# EAGLE design Pixel-X_Display_v4_sk6805-2427-40pixel_0.97x_re_place-1 (EAGLE 7.7.0)
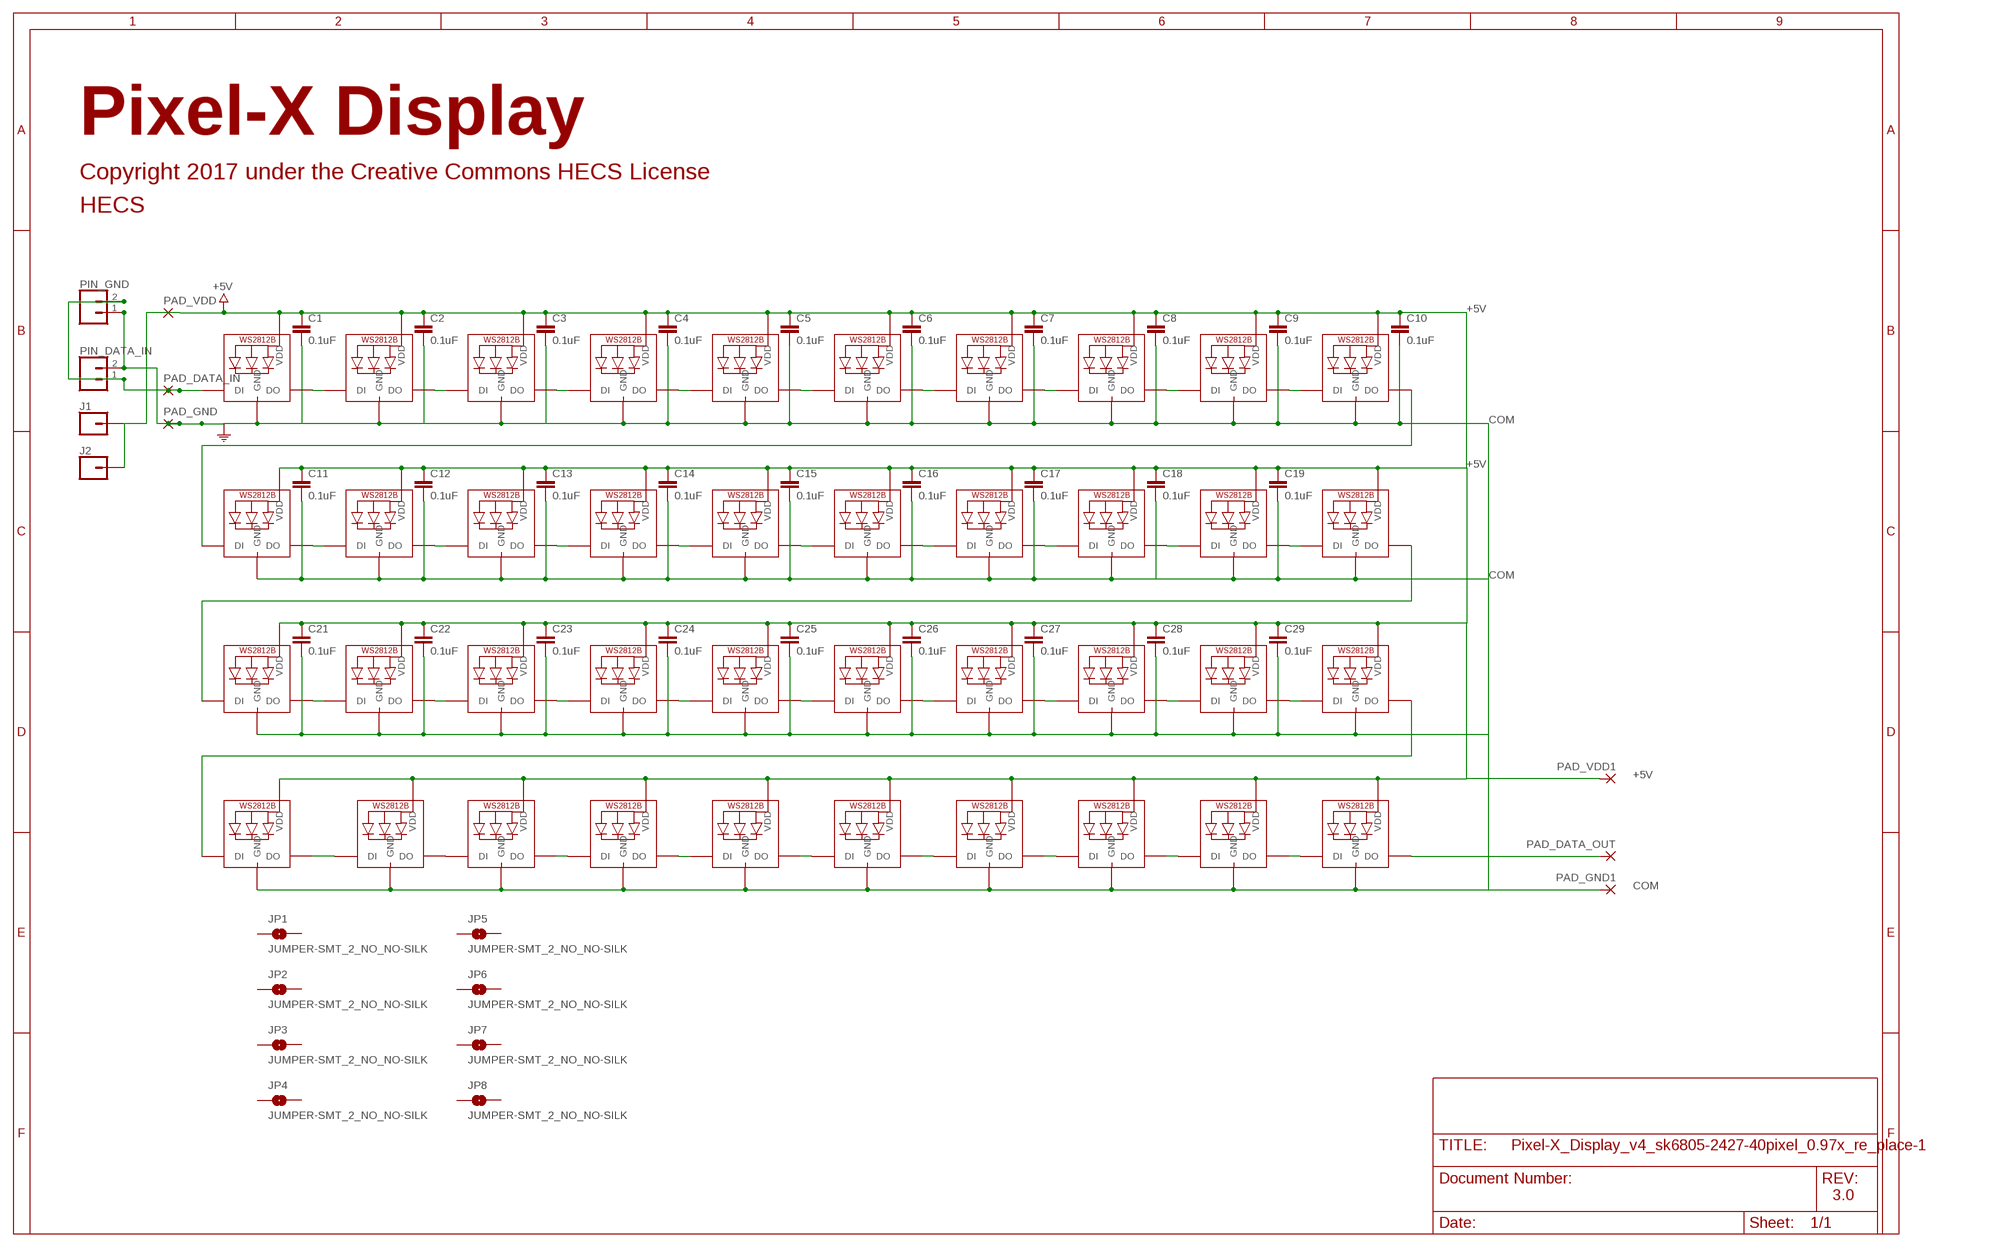
[diagram p0: schematic, sheet 1]

## Parts
C1  0.1uF  0.1UF-0603-25V-(+80/-20%)  [0603]
C2  0.1uF  0.1UF-0603-25V-(+80/-20%)  [0603]
C3  0.1uF  0.1UF-0603-25V-(+80/-20%)  [0603]
C4  0.1uF  0.1UF-0603-25V-(+80/-20%)  [0603]
C5  0.1uF  0.1UF-0603-25V-(+80/-20%)  [0603]
C6  0.1uF  0.1UF-0603-25V-(+80/-20%)  [0603]
C7  0.1uF  0.1UF-0603-25V-(+80/-20%)  [0603]
C8  0.1uF  0.1UF-0603-25V-(+80/-20%)  [0603]
C9  0.1uF  0.1UF-0603-25V-(+80/-20%)  [0603]
C10  0.1uF  0.1UF-0603-25V-(+80/-20%)  [0603]
C11  0.1uF  0.1UF-0603-25V-(+80/-20%)  [0603]
C12  0.1uF  0.1UF-0603-25V-(+80/-20%)  [0603]
C13  0.1uF  0.1UF-0603-25V-(+80/-20%)  [0603]
C14  0.1uF  0.1UF-0603-25V-(+80/-20%)  [0603]
C15  0.1uF  0.1UF-0603-25V-(+80/-20%)  [0603]
C16  0.1uF  0.1UF-0603-25V-(+80/-20%)  [0603]
C17  0.1uF  0.1UF-0603-25V-(+80/-20%)  [0603]
C18  0.1uF  0.1UF-0603-25V-(+80/-20%)  [0603]
C19  0.1uF  0.1UF-0603-25V-(+80/-20%)  [0603]
C21  0.1uF  0.1UF-0603-25V-(+80/-20%)  [0603]
C22  0.1uF  0.1UF-0603-25V-(+80/-20%)  [0603]
C23  0.1uF  0.1UF-0603-25V-(+80/-20%)  [0603]
C24  0.1uF  0.1UF-0603-25V-(+80/-20%)  [0603]
C25  0.1uF  0.1UF-0603-25V-(+80/-20%)  [0603]
C26  0.1uF  0.1UF-0603-25V-(+80/-20%)  [0603]
C27  0.1uF  0.1UF-0603-25V-(+80/-20%)  [0603]
C28  0.1uF  0.1UF-0603-25V-(+80/-20%)  [0603]
C29  0.1uF  0.1UF-0603-25V-(+80/-20%)  [0603]
J1  CONN_01  [1X01]
J2  CONN_01  [1X01]
JP1  JUMPER-SMT_2_NO_NO-SILK  [SMT-JUMPER_2_NO_NO-SILK]
JP2  JUMPER-SMT_2_NO_NO-SILK  [SMT-JUMPER_2_NO_NO-SILK]
JP3  JUMPER-SMT_2_NO_NO-SILK  [SMT-JUMPER_2_NO_NO-SILK]
JP4  JUMPER-SMT_2_NO_NO-SILK  [SMT-JUMPER_2_NO_NO-SILK]
JP5  JUMPER-SMT_2_NO_NO-SILK  [SMT-JUMPER_2_NO_NO-SILK]
JP6  JUMPER-SMT_2_NO_NO-SILK  [SMT-JUMPER_2_NO_NO-SILK]
JP7  JUMPER-SMT_2_NO_NO-SILK  [SMT-JUMPER_2_NO_NO-SILK]
JP8  JUMPER-SMT_2_NO_NO-SILK  [SMT-JUMPER_2_NO_NO-SILK]
LED1  WS2812BSK68052427  [LED3535]
LED2  WS2812BSK68052427  [LED3535]
LED3  WS2812BSK68052427  [LED3535]
LED4  WS2812BSK68052427  [LED3535]
LED5  WS2812BSK68052427  [LED3535]
LED6  WS2812BSK68052427  [LED3535]
LED7  WS2812BSK68052427  [LED3535]
LED8  WS2812BSK68052427  [LED3535]
LED9  WS2812BSK68052427  [LED3535]
LED10  WS2812BSK68052427  [LED3535]
LED11  WS2812BSK68052427  [LED3535]
LED12  WS2812BSK68052427  [LED3535]
LED13  WS2812BSK68052427  [LED3535]
LED14  WS2812BSK68052427  [LED3535]
LED15  WS2812BSK68052427  [LED3535]
LED16  WS2812BSK68052427  [LED3535]
LED17  WS2812BSK68052427  [LED3535]
LED18  WS2812BSK68052427  [LED3535]
LED19  WS2812BSK68052427  [LED3535]
LED20  WS2812BSK68052427  [LED3535]
LED21  WS2812BSK68052427  [LED3535]
LED22  WS2812BSK68052427  [LED3535]
LED23  WS2812BSK68052427  [LED3535]
LED24  WS2812BSK68052427  [LED3535]
LED25  WS2812BSK68052427  [LED3535]
LED26  WS2812BSK68052427  [LED3535]
LED27  WS2812BSK68052427  [LED3535]
LED28  WS2812BSK68052427  [LED3535]
LED29  WS2812BSK68052427  [LED3535]
LED30  WS2812BSK68052427  [LED3535]
LED31  WS2812BSK68052427  [LED3535]
LED32  WS2812BSK68052427  [LED3535]
LED33  WS2812BSK68052427  [LED3535]
LED34  WS2812BSK68052427  [LED3535]
LED35  WS2812BSK68052427  [LED3535]
LED36  WS2812BSK68052427  [LED3535]
LED37  WS2812BSK68052427  [LED3535]
LED38  WS2812BSK68052427  [LED3535]
LED39  WS2812BSK68052427  [LED3535]
LED40  WS2812BSK68052427  [LED3535]
PAD_DATA_IN  SMD5  [SMD2,54-5,08]
PAD_DATA_OUT  SMD5  [SMD2,54-5,08]
PAD_GND  SMD5  [SMD2,54-5,08]
PAD_GND1  SMD5  [SMD2,54-5,08]
PAD_VDD  SMD5  [SMD2,54-5,08]
PAD_VDD1  SMD5  [SMD2,54-5,08]
PIN_DATA_IN  CONN_02  [1X02]
PIN_GND  CONN_02  [1X02]

## Nets
+5V: C1.1 C2.1 C3.1 C4.1 C5.1 C6.1 C7.1 C8.1 C9.1 C10.1 C11.1 C12.1 C13.1 C14.1 C15.1 C16.1 C17.1 C18.1 C19.1 C21.1 C22.1 C23.1 C24.1 C25.1 C26.1 C27.1 C28.1 C29.1 J1.1 J2.1 LED1.2(VDD) LED2.2(VDD) LED3.2(VDD) LED4.2(VDD) LED5.2(VDD) LED6.2(VDD) LED7.2(VDD) LED8.2(VDD) LED9.2(VDD) LED10.2(VDD) LED11.2(VDD) LED12.2(VDD) LED13.2(VDD) LED14.2(VDD) LED15.2(VDD) LED16.2(VDD) LED17.2(VDD) LED18.2(VDD) LED19.2(VDD) LED20.2(VDD) LED21.2(VDD) LED22.2(VDD) LED23.2(VDD) LED24.2(VDD) LED25.2(VDD) LED26.2(VDD) LED27.2(VDD) LED28.2(VDD) LED29.2(VDD) LED30.2(VDD) LED31.2(VDD) LED32.2(VDD) LED33.2(VDD) LED34.2(VDD) LED35.2(VDD) LED36.2(VDD) LED37.2(VDD) LED38.2(VDD) LED39.2(VDD) LED40.2(VDD) PAD_VDD1.1(P) PAD_VDD.1(P)
COM: C1.2 C2.2 C3.2 C4.2 C5.2 C6.2 C7.2 C8.2 C9.2 C10.2 C11.2 C12.2 C13.2 C14.2 C15.2 C16.2 C17.2 C18.2 C19.2 C21.2 C22.2 C23.2 C24.2 C25.2 C26.2 C27.2 C28.2 C29.2 LED1.4(GND) LED2.4(GND) LED3.4(GND) LED4.4(GND) LED5.4(GND) LED6.4(GND) LED7.4(GND) LED8.4(GND) LED9.4(GND) LED10.4(GND) LED11.4(GND) LED12.4(GND) LED13.4(GND) LED14.4(GND) LED15.4(GND) LED16.4(GND) LED17.4(GND) LED18.4(GND) LED19.4(GND) LED20.4(GND) LED21.4(GND) LED22.4(GND) LED23.4(GND) LED24.4(GND) LED25.4(GND) LED26.4(GND) LED27.4(GND) LED28.4(GND) LED29.4(GND) LED30.4(GND) LED31.4(GND) LED32.4(GND) LED33.4(GND) LED34.4(GND) LED35.4(GND) LED36.4(GND) LED37.4(GND) LED38.4(GND) LED39.4(GND) LED40.4(GND) PAD_GND1.1(P) PAD_GND.1(P) PIN_DATA_IN.2 PIN_GND.1
N$1: LED1.1(DI) PAD_DATA_IN.1(P) PIN_DATA_IN.1 PIN_GND.2
N$2: LED1.3(DO) LED2.1(DI)
N$3: LED2.3(DO) LED3.1(DI)
N$4: LED3.3(DO) LED4.1(DI)
N$5: LED4.3(DO) LED5.1(DI)
N$6: LED5.3(DO) LED6.1(DI)
N$7: LED29.3(DO) LED30.1(DI)
N$8: LED6.3(DO) LED7.1(DI)
N$9: LED7.3(DO) LED8.1(DI)
N$10: LED8.3(DO) LED9.1(DI)
N$11: LED9.3(DO) LED10.1(DI)
N$12: LED10.3(DO) LED11.1(DI)
N$13: LED11.3(DO) LED12.1(DI)
N$14: LED12.3(DO) LED13.1(DI)
N$15: LED13.3(DO) LED14.1(DI)
N$16: LED15.3(DO) LED16.1(DI)
N$17: LED16.3(DO) LED17.1(DI)
N$18: LED17.3(DO) LED18.1(DI)
N$19: LED18.3(DO) LED19.1(DI)
N$20: LED19.3(DO) LED20.1(DI)
N$21: LED14.3(DO) LED15.1(DI)
N$22: LED20.3(DO) LED21.1(DI)
N$23: LED21.3(DO) LED22.1(DI)
N$24: LED22.3(DO) LED23.1(DI)
N$25: LED23.3(DO) LED24.1(DI)
N$26: LED24.3(DO) LED25.1(DI)
N$27: LED25.3(DO) LED26.1(DI)
N$28: LED26.3(DO) LED27.1(DI)
N$29: LED27.3(DO) LED28.1(DI)
N$30: LED28.3(DO) LED29.1(DI)
N$31: LED30.3(DO) LED31.1(DI)
N$32: LED39.3(DO) LED40.1(DI)
N$33: LED38.3(DO) LED39.1(DI)
N$34: LED37.3(DO) LED38.1(DI)
N$35: LED36.3(DO) LED37.1(DI)
N$36: LED35.3(DO) LED36.1(DI)
N$37: LED34.3(DO) LED35.1(DI)
N$38: LED33.3(DO) LED34.1(DI)
N$39: LED32.3(DO) LED33.1(DI)
N$40: LED31.3(DO) LED32.1(DI)
N$41: LED40.3(DO) PAD_DATA_OUT.1(P)
Unconnected: JP1.1 JP1.2 JP2.1 JP2.2 JP3.1 JP3.2 JP4.1 JP4.2 JP5.1 JP5.2 JP6.1 JP6.2 JP7.1 JP7.2 JP8.1 JP8.2

## Notes on the sheet
- Pixel-X Display
- Copyright 2017 under the Creative Commons HECS License
- HECS
- 3.0

## Library data of the parts
C1-C19 C21-C29 = SparkFun-Capacitors:0.1UF: 0.1µF ceramic capacitors A capacitor is a passive two-terminal electrical component used to store electrical energy temporarily in an electric field.; PROD_ID: CAP-00810
J1 J2 = SparkFun-Connectors:CONN_01: Single connection point. Often used as Generic Header-pin footprint for 0.1 inch spaced/style header connections On any of the 0.1 inch spaced packages, you can populate with these: Break Away Headers - Straight <https://www.sparkfun.com/products/116> (PRT-00116) Break Away Male Headers - Right Angle <https://www.sparkfun.com/products/553> (PRT-00553) Female Headers <https://www.sparkfun.com/products/115> (PRT-00115) Break Away Headers - Machine Pin <https://www.sparkfun.com/products/117> (PRT-00117) Break Away Female Headers - Swiss Machine Pin <https://www.sparkfun.com/products/743> (PRT-00743) This device is also useful as a general connection point to wire up your design to another part of your project. Our various solder wires solder well into these plated through hole pads. Hook-Up Wire - Assortment (Stranded, 22 AWG) <https://www.sparkfun.com/products/11375> (PRT-11375) Hook-Up Wire - Assortment (Solid Core, 22 AWG) <https://www.sparkfun.com/products/11367> (PRT-11367) View the entire wire category on our website here <https://www.sparkfun.com/categories/141> Special notes: SMTSO-256-ET is a "flush mount" nut for a 4-40 screw. We mostly use this on specialty testbeds; it is a nice way to connect hardware to your PCB at an adjustable hieght. Also note, the SNAP packages are for using a snappable style connector. We sell a baggie of snaps and they are also used on two LilyPad designs: Snap Assortment - 30 pack (male and female) <https://www.sparkfun.com/products/11347> (DEV-11347) LilyPad Arduino SimpleSnap <https://www.sparkfun.com/products/10941> (DEV-10941) LilyPad SimpleSnap Protoboard <https://www.sparkfun.com/products/10940> (DEV-10940)
JP1-JP8 = SparkFun-Jumpers:JUMPER-SMT_2_NO: Normally open jumper This jumper has two pads in close proximity to each other. Apply solder to close the connection. Round pads are easier to solder for beginners, but are a lot larger. SparkFun Product that uses the round pads: SparkFun EL Sequencer <https://www.sparkfun.com/products/12781>
LED1-LED40 = SK6805-2427:WS2812B
PAD_DATA_IN PAD_DATA_OUT PAD_GND PAD_GND1 PAD_VDD PAD_VDD1 = wirepad:SMD5: SMD PAD
PIN_DATA_IN PIN_GND = SparkFun-Connectors:CONN_02: Multi connection point. Often used as Generic Header-pin footprint for 0.1 inch spaced/style header connections On any of the 0.1 inch spaced packages, you can populate with these: Break Away Headers - Straight <https://www.sparkfun.com/products/116> (PRT-00116) Break Away Male Headers - Right Angle <https://www.sparkfun.com/products/553> (PRT-00553) Female Headers <https://www.sparkfun.com/products/115> (PRT-00115) Break Away Headers - Machine Pin <https://www.sparkfun.com/products/117> (PRT-00117) Break Away Female Headers - Swiss Machine Pin <https://www.sparkfun.com/products/743> (PRT-00743) For SCREWTERMINALS and SPRING TERMINALS visit here: Screw Terimnals on SparkFun.com <https://www.sparkfun.com/search/results?term=Screw+Terminals> (5mm/3.5mm/2.54mm spacing) This device is also useful as a general connection point to wire up your design to another part of your project. Our various solder wires solder well into these plated through hole pads. Hook-Up Wire - Assortment (Stranded, 22 AWG) <https://www.sparkfun.com/products/11375> (PRT-11375) Hook-Up Wire - Assortment (Solid Core, 22 AWG) <https://www.sparkfun.com/products/11367> (PRT-11367) View the entire wire category on our website here <https://www.sparkfun.com/categories/141> Special notes: Molex polarized connector foot print use with: PRT-08233 with associated crimp pins and housings. 2.54_SCREWTERM for use with PRT-10571. 3.5mm Screw Terminal footprints for PRT-08084 5mm Screw Terminal footprints for use with PRT-08432

## Board
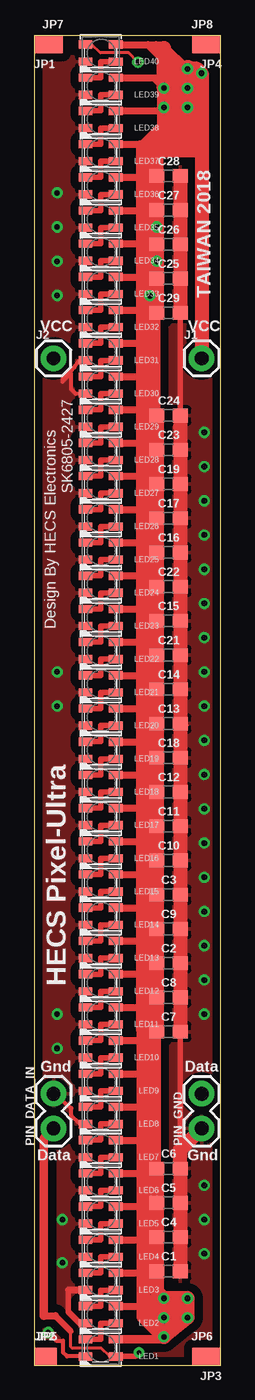
[diagram p1: board, top side]
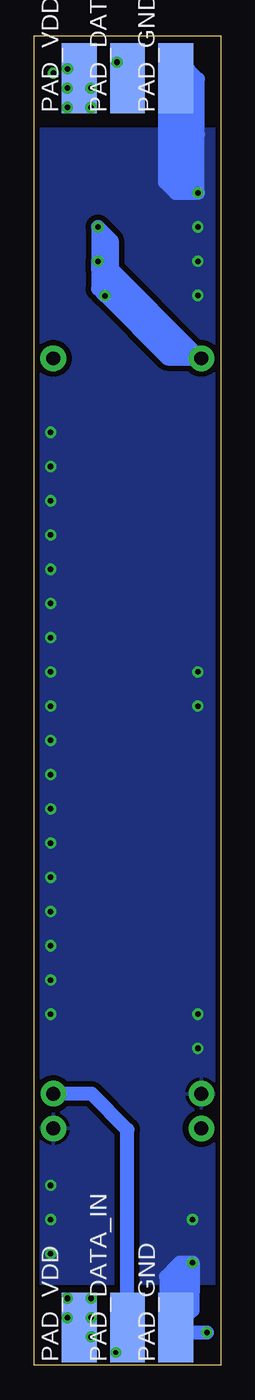
[diagram p2: board, bottom side, seen from below]

Size 13.6 x 97.07 mm. Coordinates in mm from the lower left corner, seen from the top.
Outline: 0,0 13.6,0 13.6,97.07 0,97.07 0,0
Copper layers (1*16): Top 0.035mm / dielectric 1.5mm / Bottom 0.035mm
Design rules "default *": minimum track width 8mil, minimum drill 16mil, track to track 8mil, track to pad 8mil, pad to pad 8mil, via to via 8mil, smd to smd 8mil, copper to edge 8mil, drill to drill 8mil, minimum pad ring 12mil, minimum via ring 8mil, stop-mask expansion 4mil, vias tented up to drill 18mil, thermal gap 10mil

### Footprints (pad centres in the part's own frame; a part is rotated, then mirrored left to right if it is on the bottom)
0603 = smd 1.1 x 1: 1 -0.85,0; 2 0.85,0
1X01 = drill 1.016 pad 1.88: 1 0,0
SMT-JUMPER_2_NO_NO-SILK = smd 0.635 x 1.27: 1 -0.406,0; 2 0.406,0
LED3535 = smd 1 x 0.6: 1 -1.5,0.075; 2 -1.5,-1.175; 3 0.7,-1.175; 4 0.7,0.075
SMD2,54-5,08 = smd 2.54 x 5.08: 1 0,0
1X02 = drill 1.016 pad 1.88: 1 0,0; 2 2.54,0

### Placement (x,y rotation side)
C1  9.8,6.86 0 top
C2  9.8,29.35 0 top
C3  9.8,34.35 0 top
C4  9.8,9.36 0 top
C5  9.8,11.86 0 top
C6  9.8,14.36 0 top
C7  9.8,24.36 0 top
C8  9.8,26.86 0 top
C9  9.8,31.85 0 top
C10  9.8,36.85 0 top
C11  9.8,39.35 0 top
C12  9.8,41.85 0 top
C13  9.8,46.85 0 top
C14  9.8,49.35 0 top
C15  9.8,54.34 0 top
C16  9.8,59.34 0 top
C17  9.8,61.84 0 top
C18  9.8,44.35 0 top
C19  9.8,64.34 0 top
C21  9.8,51.84 0 top
C22  9.8,56.84 0 top
C23  9.8,66.84 0 top
C24  9.8,69.34 0 top
C25  9.8,79.33 0 top
C26  9.8,81.83 0 top
C27  9.8,84.33 0 top
C28  9.8,86.83 0 top
C29  9.8,76.83 0 top
J1  12.21,73.51 0 top
J2  1.4,73.51 0 top
JP1  0.72,96.43 180 top
JP2  0.74,0.64 0 top
JP3  12.88,0.64 180 top
JP4  12.88,96.43 180 top
JP5  0.93,0.63 0 top
JP6  12.24,0.64 0 top
JP7  1.36,96.43 0 top
JP8  12.24,96.43 0 top
LED1  4.44,0.71 180 top
LED2  4.44,3.14 180 top
LED3  4.44,5.56 180 top
LED4  4.44,7.99 180 top
LED5  4.44,10.41 180 top
LED6  4.44,12.84 180 top
LED7  4.44,15.26 180 top
LED8  4.44,17.68 180 top
LED9  4.44,20.11 180 top
LED10  4.44,22.53 180 top
LED11  4.44,24.96 180 top
LED12  4.44,27.38 180 top
LED13  4.44,29.8 180 top
LED14  4.44,32.23 180 top
LED15  4.44,34.65 180 top
LED16  4.44,37.08 180 top
LED17  4.44,39.5 180 top
LED18  4.44,41.92 180 top
LED19  4.44,44.35 180 top
LED20  4.44,46.77 180 top
LED21  4.44,49.2 180 top
LED22  4.44,51.62 180 top
LED23  4.44,54.04 180 top
LED24  4.44,56.47 180 top
LED25  4.44,58.89 180 top
LED26  4.44,61.32 180 top
LED27  4.44,63.74 180 top
LED28  4.44,66.16 180 top
LED29  4.44,68.59 180 top
LED30  4.44,71.01 180 top
LED31  4.44,73.44 180 top
LED32  4.44,75.86 180 top
LED33  4.44,78.28 180 top
LED34  4.44,80.71 180 top
LED35  4.44,83.13 180 top
LED36  4.44,85.56 180 top
LED37  4.44,87.98 180 top
LED38  4.44,90.4 180 top
LED39  4.44,92.83 180 top
LED40  4.44,95.25 180 top
PAD_DATA_IN  6.8,2.75 0 bottom
PAD_DATA_OUT  6.8,93.97 0 bottom
PAD_GND  3.27,2.76 0 bottom
PAD_GND1  3.29,93.97 0 bottom
PAD_VDD  10.32,2.76 0 bottom
PAD_VDD1  10.32,93.97 0 bottom
PIN_DATA_IN  1.4,17.28 90 top
PIN_GND  12.21,17.28 90 top

### Tracks (layer width: path | path; a pad name or v marks a point on that pad's centre or on a via)
+5V  (via drill 0.41)
  Top 0.508: 8.95,74.3 C29.1 8.93,76.86 8.36,76.86 7.89,76.86 | 8.95,74.3 8.95,71.84 | 8.95,71.84 C24.1 8.53,69.34 7.89,69.34 | 8.95,21.77 C7.1 8.93,24.38 | 8.95,21.77 8.95,19.37 | 8.95,19.37 8.95,16.91 | 8.95,16.91 C6.1 8.93,14.38 8.38,14.38 7.99,14.38 | 8.96,4.39 v9.46,4.89 | 8.93,16.88 8.95,16.91 | 8.94,19.38 8.95,19.37 | 8.83,21.88 8.95,21.77 | 7.96,24.38 8.03,24.38 | 8.93,26.88 C8.1 | 8.93,29.38 C2.1 | 8.93,31.88 C9.1 | 8.93,36.88 C10.1 | 8.93,41.87 C12.1 | 8.93,44.37 C18.1 | 8.93,46.87 C13.1 | 8.93,49.37 C14.1 | 8.93,54.37 C15.1 | 8.93,56.87 C22.1 | 8.93,59.37 C16.1 | 8.93,71.86 8.95,71.84 | 8.89,74.36 8.95,74.3 | 8.93,79.36 C25.1 | 8.93,81.86 C26.1 | 8.93,84.36 C27.1 | LED40.2 8.28,96.43 | 8.28,96.43 8.88,96.43 | 8.88,96.43 9.41,96.43 v11.18,94.66 | LED39.2 8.71,94 | 8.71,94 v9.46,93.25 | 8.71,94 10.24,94 10.53,94 v11.18,94.66 | LED38.2 9.45,91.58 9.46,91.59 | LED37.2 7.7,89.16 7.96,88.89 | LED36.2 7.64,86.73 7.96,86.41 | LED35.2 7.74,84.31 7.96,84.08 | LED34.2 7.83,81.88 7.96,81.75 | LED33.2 7.9,79.46 7.96,79.4 | LED32.2 7.93,77.03 7.96,77.07 | LED31.2 7.88,74.61 7.89,74.61 | LED30.2 7.85,72.19 7.89,72.15 | LED29.2 7.69,69.76 7.96,70.04 | LED28.2 7.61,67.34 7.96,67.69 | LED27.2 7.58,64.92 7.96,65.3 | LED26.2 7.91,62.49 7.96,62.44 | LED25.2 7.95,60.07 7.96,60.08 | LED24.2 7.95,57.64 7.96,57.63 | LED23.2 7.96,55.22 | LED22.2 7.9,52.8 7.96,52.74 | LED21.2 7.96,50.37 7.96,50.38 | LED20.2 7.94,47.95 7.96,47.97 | LED19.2 7.9,45.52 7.96,45.58 | LED18.2 7.94,43.1 7.96,43.08 | LED17.2 7.95,40.67 7.96,40.69 | LED16.2 7.92,38.25 7.96,38.29 | LED15.2 7.94,35.83 7.96,35.84 | LED14.2 7.94,33.4 7.96,33.42 | LED13.2 7.92,30.98 7.96,30.94 | LED12.2 7.96,28.55 | LED11.2 7.95,26.13 7.96,26.14
  Top 0.508: LED10.2 7.95,23.71 7.96,23.7 | LED9.2 7.94,21.28 7.96,21.3 | LED8.2 7.94,18.86 7.96,18.88 | LED7.2 7.93,16.43 7.96,16.41 | LED6.2 7.63,14.01 7.99,13.64 | LED5.2 7.62,11.59 7.99,11.21 | LED4.2 7.78,9.16 7.99,8.94 | LED3.2 7.85,6.74 7.99,6.6 | LED2.2 7.96,4.31 | 7.96,4.31 | 8.28,96.43 8.88,95.83 | 8.88,95.83 10.05,94.66 v11.18,94.66 | 8.88,96.43 8.88,95.83
  Top 0.61: 8.36,76.86 8.36,69.51 8.53,69.34 8.53,76.42 C29.1 | C24.1 7.89,69.34 7.89,72.15 7.89,74.61 7.89,76.86 8.93,76.86 | 8.38,14.38 8.38,23.79 C7.1 C6.1 8.02,14.36 7.99,14.38 | 7.99,24.35 7.96,24.38 | 8.03,24.38 8.93,24.38 | LED1.2 9.27,1.89 v9.46,2.07 | 7.99,4.24 7.99,4.25 | 7.99,6.59 7.99,6.6 | 7.99,8.94 | 7.92,11.29 7.99,11.21 | 7.99,13.63 7.99,13.64 | 7.96,15.98 7.99,15.95 | 7.98,18.33 7.99,18.32 | 7.96,20.68 7.99,20.65 | 7.95,23.03 7.99,22.99 | 7.96,25.38 | 7.95,27.73 7.96,27.72 | 7.93,30.08 7.96,30.05 | 7.96,32.43 | 7.92,34.78 7.96,34.82 | 7.96,37.12 7.96,37.13 | 7.91,39.47 7.96,39.53 | 7.94,41.82 7.96,41.8 | 7.93,44.17 7.96,44.21 | 7.94,46.52 7.96,46.5 | 7.96,48.87 | 7.95,51.22 7.96,51.23 | 7.92,53.57 7.96,53.6 | 7.94,55.92 7.96,55.9 | 7.87,58.27 7.96,58.36 | 7.91,60.62 7.96,60.67 | 7.94,62.96 7.96,62.99 | 7.94,65.31 7.96,65.3 | 7.93,67.66 7.96,67.69 | 7.93,70.01 7.96,70.04 | 7.94,72.36 7.96,72.34 | 7.92,74.71 7.96,74.67 | 7.95,77.06 7.96,77.07 | 7.96,79.41 7.96,79.4 | 7.96,81.76 7.96,81.75 | 7.94,84.11 7.96,84.08 | 7.92,86.45 7.96,86.41 | 7.87,88.8 7.96,88.89
  Top 0.813: 9.41,96.12 9.46,96.16 10.24,95.28 10.24,94
  Top 1.016: C26.1 C27.1 C28.1 8.95,88.71 | C25.1 8.95,78.05 | C24.1 C23.1 C19.1 C17.1 C16.1 C22.1 C15.1 C21.1 C14.1 C13.1 C18.1 C12.1 C11.1 C10.1 C3.1 C9.1 C2.1 C8.1 C7.1 | C6.1 C5.1 C4.1 C1.1 8.95,5.39 v9.46,4.89 | v9.46,4.89 v9.46,3.48 | v9.46,3.48 v9.46,2.07 | 8.95,78.05 8.95,85.55 8.95,78.05 C25.1 | 8.95,78.05 C29.1 | v8.95,80.61 8.95,80.59 C26.1 | v8.95,83.11 8.95,83.04 C26.1 | C26.1 C25.1 | v11.18,4.89 v9.46,4.89 | v11.18,3.48 v9.46,3.48 | v11.18,3.48 v9.46,2.07 | v11.18,3.48 | v11.18,3.48 v11.18,4.89 | v11.18,4.89 9.77,3.48 v9.46,3.48 | v9.46,3.48 9.78,3.48 v11.18,3.48 | v9.46,3.48 7.99,4.94 | 7.99,4.94 7.99,6.6 7.99,8.94 7.99,11.21 7.99,13.64 7.99,14.38 7.99,15.95 7.99,18.32 7.99,20.65 7.99,22.99 7.99,24.35 8.03,24.38 | v9.46,2.07 7.99,3.53 | 7.99,3.53 7.99,4.25 7.99,4.94 | 7.96,24.38 7.96,25.38 7.96,26.14 7.96,27.72 7.96,28.55 7.96,30.05 7.96,30.94 7.96,32.43 7.96,33.42 7.96,34.82 7.96,35.84 7.96,37.13 7.96,38.29 7.96,39.53 7.96,40.69 7.96,41.8 7.96,43.08 7.96,44.21 7.96,45.58 7.96,46.5 7.96,47.97 7.96,48.87 7.96,50.38 7.96,51.23 7.96,52.74 7.96,53.6 7.96,55.22 7.96,55.9 7.96,57.63 7.96,58.36 7.96,60.08 7.96,60.67 7.96,62.44 7.96,62.99 7.96,65.3 7.96,67.69 7.96,70.04 7.96,72.34 7.96,74.67 7.96,77.07 7.96,79.4 7.96,81.75 7.96,84.08 7.96,86.41 7.96,88.45 | 7.96,88.45 7.96,88.89 9.46,90.39 v9.46,91.84 v9.47,91.85 10.86,91.85 | 12.21,90.14 v12.21,94.33 11.88,94.66 v11.18,94.66 | 12.21,90.14 12.21,89.55 | 12.21,89.55 12.21,88.72 | 12.21,88.72 J1.1 | v11.19,93.25 11.18,90.67 10.66,90.14 | v9.46,93.25 9.46,91.59 9.46,90.66 | v9.46,93.25 11.07,93.25 11.18,93.14 | v9.46,93.25 10.86,91.85
  Top 1.016: 10.86,91.85 v11.18,91.85 | 10.66,90.14 8.96,88.45 7.96,88.45 | 8.95,88.71 8.95,89.6 9.28,89.93 | 9.28,89.93 v11.19,91.84 | 8.95,88.71 12.19,88.71 12.21,88.72 | 12.21,89.55 9.66,89.55 9.28,89.93 | 10.66,90.14 12.21,90.14 | 7.96,25.38 7.96,23.7 7.96,21.3 7.96,18.88 7.96,16.41 7.96,4.31 7.96,3.57 7.99,3.53 | v9.46,93.25 9.46,96.16
  Top 1.27: v11.18,94.66 11.18,93.14 v11.18,91.85 11.18,90.67 | v11.19,93.25 v11.19,91.84
  Bottom 0.203: PAD_VDD.1 10,3 9.5,3.5 v9.46,3.48 | 11,92 10.5,91.5 | 11,92 PAD_VDD1.1 | 11,92 v11.19,91.84
  Bottom 1.016: v8.95,80.61 v8.95,83.11 7.96,82.12 7.96,78.44 | 8.5,80.61 J2.1 2.46,73.51 | 8.5,80.61 v8.95,80.61 | 8.5,78.14 v8.44,78.08 3.87,73.51 3.04,73.51 | 8.5,78.14 8.5,78.97 | 8.5,78.97 8.5,80.61 | v8.95,80.61 8.95,78.59 8.5,78.14 | 3.04,73.51 2.46,73.51 | 3.04,73.51 7.96,78.44 | 7.96,78.44 8.5,78.97 | 2.46,73.51 8.95,80 v8.95,80.61
COM  (via drill 0.41)
  Top 0.2: LED1.4 3.61,0.77
  Top 0.203: 3.5,3 LED2.4 | 3.5,5.5 3.59,5.5 LED3.4 | 11,68.5 10.65,68.5 | 10.77,69 11,69 C24.2 | 11.18,46.74 C13.2
  Top 0.254: 3.65,17.76 LED8.4 | 3.53,73.28 LED31.4 | 2.93,72.87 2.97,72.96 | 3.02,70.94 LED30.4 | LED2.4 3.31,3.06 | 2.46,3.91 2.48,3.93 | 3.59,5.5
  Top 0.305: LED1.4 2.39,0.64 2.08,0.95 2.08,1.79 1.61,1.79 v1.01,2.39 | PIN_DATA_IN.2 2.7,18.76 2.7,18.22 3.18,17.75 3.65,17.76 | 3.53,73.28 3.21,73.28 2.97,72.96 | 2.93,72.87 2.66,72.6 | 2.66,72.41 2.66,71.29 3.02,70.94 | 2.66,72.6 2.05,71.99 2.05,71.8 2.66,72.41 | 2.66,72.41 2.66,72.6
  Top 0.406: C29.2 C24.2 | C7.2 C6.2 | 3.31,3.06 2.46,3.91 | 2.48,3.93 2.48,5.5
  Top 0.508: 2.48,5.5 3.59,5.5
  Top 1.016: C28.2 C27.2 C26.2 C25.2 C29.2 | C24.2 10.65,68.5 C23.2 C19.2 C17.2 C16.2 C22.2 C15.2 C21.2 C14.2 C13.2 C18.2 C12.2 C11.2 C10.2 C3.2 C9.2 C2.2 C8.2 C7.2 | C1.2 C4.2 C5.2 C6.2 10.65,15.73 PIN_GND.1
  Bottom 0.203: 2.32,85.75 2.43,85.75 3.03,85.75 3.25,85.75 3.25,89.85 3.25,91.25 PAD_GND1.1
  Bottom 0.406: PAD_GND.1 3.04,2.52
  Bottom 1.016: v2.05,7.48 2.06,4.01 PAD_GND.1 | PAD_GND.1 3.27,3.24 | 3.27,3.24 3.27,4.02 | 3.27,4.02 3.27,4.77 | 3.27,4.77 3.27,6.78 3.22,6.83 2.78,6.83 | v2.05,7.48 2.55,6.62 2.55,4.63 3.13,4.63 3.27,4.77 | 3.27,3.24 3.98,3.95 3.98,6.47 3.27,7.18 | v1.66,85.61 1.66,89.85 2.43,89.85 | 2.43,89.85 3.25,89.85 | PAD_GND1.1 3.29,85.61 | 3.29,85.61 v1.66,85.61 | 2.43,85.75 2.43,89.85 | v1.66,85.61 1.66,93.9 2.32,94.56 2.32,85.75 | 3.29,85.61 4.05,86.37 4.05,92.82 3.03,91.79 3.03,85.75 | v2.05,7.48 2.97,7.48 3.27,7.18 | v2.05,7.48 2.05,5.24 3.27,4.02 | PAD_GND.1 3.27,7.18 | v1.01,2.39 2.9,2.39 PAD_GND.1
  other vias: 12.41,45.62 12.41,40.63 12.41,38.13 12.41,33.13 12.41,25.63 1.66,48.12 1.66,23.13 1.66,25.63 12.41,28.13 12.41,30.63 12.41,35.63 12.41,43.12 12.41,48.12 12.41,50.62 12.41,53.12 12.41,55.62 12.41,58.12 12.41,60.62 12.41,63.12 12.41,65.62 12.41,68.11 1.66,78.11 1.66,80.61 1.66,83.11 12.41,8.14 12.41,10.64 12.41,13.14 2.05,10.64 1.66,50.62
  pour Top (isolate 0.61): 0.25,0.25 0.25,96.48 13.35,96.48 13.35,0.25
  pour Bottom (isolate 0.406): 0.25,6 0.25,90.24 13.35,90.24 13.35,6
N$1  (via drill 0.35)
  Top 0.203: LED1.1 5.49,0.64 4.88,1.25 2.77,1.25 2.68,1.34 2.68,2.48
  Top 0.406: LED1.1 7.35,0.64 v7.65,0.93 | 1.54,3.61 2.68,2.48
  Top 0.508: 0.67,3.61 1.54,3.61
  Top 0.61: 0.67,3.61 0.67,16.55 PIN_DATA_IN.1
  Bottom 0.203: 5.69,1.02 5.69,1.63 6.71,2.64 PAD_DATA_IN.1
  Bottom 0.406: PAD_DATA_IN.1 6.8,1.78 v7.65,0.93
  Bottom 0.813: PAD_DATA_IN.1 6.8,14.42
  Bottom 1.016: PAD_DATA_IN.1 6.8,17.2 9.42,19.82 PIN_GND.2
N$2
  Top 0.406: LED2.1 4.84,3.06 4.84,1.89 LED1.3
N$3
  Top 0.406: LED3.1 4.84,5.49 4.84,4.31 LED2.3
N$4
  Top 0.406: LED4.1 4.84,7.91 4.84,6.74 LED3.3
N$5
  Top 0.406: LED5.1 4.84,10.34 4.84,9.16 LED4.3
N$6
  Top 0.406: LED6.1 4.84,12.76 4.84,11.59 LED5.3
N$7
  Top 0.406: LED30.1 4.84,70.94 4.84,69.76 LED29.3
N$8
  Top 0.406: LED7.1 4.84,15.18 4.84,14.01 LED6.3
N$9
  Top 0.406: LED8.1 4.84,17.61 4.84,16.44 LED7.3
N$10
  Top 0.406: LED9.1 4.84,20.03 4.84,18.86 LED8.3 | LED8.3
N$11
  Top 0.406: LED10.1 4.84,22.46 4.84,21.28 LED9.3
N$12
  Top 0.406: LED11.1 4.84,24.88 4.84,23.7 LED10.3
N$13
  Top 0.406: LED12.1 4.84,27.3 4.84,26.13 LED11.3 | LED11.3
N$14
  Top 0.406: LED13.1 4.84,29.73 4.84,28.55 LED12.3
N$15
  Top 0.406: LED14.1 4.84,32.15 4.84,30.98 LED13.3 | LED13.3
N$16
  Top 0.406: LED16.1 4.84,37 4.84,35.82 LED15.3
N$17
  Top 0.406: LED17.1 4.84,39.42 4.84,38.25 LED16.3
N$18
  Top 0.406: LED18.1 4.84,41.85 4.84,40.68 LED17.3
N$19
  Top 0.406: LED19.1 4.84,44.27 4.84,43.1 LED18.3
N$20
  Top 0.406: LED20.1 4.84,46.7 4.84,45.52 LED19.3
N$21
  Top 0.406: LED15.1 4.84,34.58 4.84,33.4 LED14.3
N$22
  Top 0.406: LED21.1 4.84,49.12 4.84,47.95 LED20.3
N$23
  Top 0.406: LED22.1 4.84,51.55 4.84,50.37 LED21.3
N$24
  Top 0.406: LED23.1 4.84,53.97 4.84,52.79 LED22.3
N$25
  Top 0.406: LED24.1 4.84,56.39 4.84,55.22 LED23.3
N$26
  Top 0.406: LED25.1 4.84,58.82 4.84,57.64 LED24.3
N$27
  Top 0.406: LED26.1 4.84,61.24 4.84,60.06 LED25.3
N$28
  Top 0.406: LED27.1 4.84,63.66 4.84,62.49 LED26.3
N$29
  Top 0.406: LED28.1 4.84,66.09 4.84,64.91 LED27.3
N$30
  Top 0.406: LED29.1 4.84,68.51 4.84,67.34 LED28.3
N$31
  Top 0.406: LED31.1 4.84,73.36 4.84,72.19 LED30.3
N$32
  Top 0.406: LED40.1 4.84,95.18 4.84,94 LED39.3
N$33
  Top 0.406: LED39.1 4.84,92.75 4.84,91.58 LED38.3
N$34
  Top 0.406: LED38.1 4.84,90.33 4.84,89.15 3.74,89.15 LED37.3
N$35
  Top 0.406: LED37.1 4.84,87.91 4.84,86.73 LED36.3
N$36
  Top 0.406: LED36.1 4.84,85.48 4.84,84.31 LED35.3
N$37
  Top 0.406: LED35.1 4.84,83.06 4.84,81.88 LED34.3
N$38
  Top 0.406: LED34.1 4.84,80.63 4.84,79.46 LED33.3
N$39
  Top 0.406: LED33.1 4.84,78.21 4.84,77.03 LED32.3
N$40
  Top 0.406: LED32.1 4.84,75.78 4.84,74.61 LED31.3
N$41  (via drill 0.41)
  Top 0.203: v7.56,95.14 6.88,95.81 4.82,95.81 4.21,96.42 LED40.3 | LED40.3 | LED40.3
  Bottom 0.203: v7.56,95.14 7.5,92 7,91.5 PAD_DATA_OUT.1

### Text on the board
tPlace: TAIWAN 2018 | VCC | VCC | SK6805-2427 | Design By HECS Electronics | HECS Pixel-Ultra | Gnd | Data | Data | Gnd